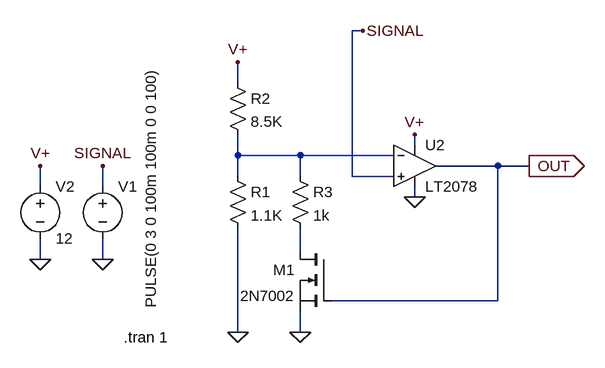
[diagram p0: schematic hysteresis_nfet.asc]
hysteresis_nfet.asc, the LTspice schematic file:
Version 4
SHEET 1 880 680
WIRE 64 -16 48 -16
WIRE -128 64 -128 32
WIRE 144 160 144 144
WIRE -128 176 -128 144
WIRE -32 176 -128 176
WIRE 112 176 -32 176
WIRE 272 192 176 192
WIRE 320 192 272 192
WIRE -128 208 -128 176
WIRE -32 208 -32 176
WIRE 48 208 48 -16
WIRE 112 208 48 208
WIRE -432 224 -432 192
WIRE -336 224 -336 192
WIRE 144 240 144 224
WIRE -32 320 -32 288
WIRE -432 336 -432 304
WIRE -336 336 -336 304
WIRE 272 400 272 192
WIRE 272 400 16 400
WIRE -128 448 -128 288
WIRE -32 448 -32 416
FLAG -128 448 0
FLAG -432 336 0
FLAG -432 192 V+
FLAG 144 144 V+
FLAG -128 32 V+
FLAG -336 192 SIGNAL
FLAG 64 -16 SIGNAL
FLAG -336 336 0
FLAG -32 448 0
FLAG 320 192 OUT
IOPIN 320 192 Out
FLAG 144 240 0
SYMBOL res -144 192 R0
SYMATTR InstName R1
SYMATTR Value 1.1K
SYMBOL res -144 48 R0
SYMATTR InstName R2
SYMATTR Value 8.5K
SYMBOL voltage -336 208 R0
WINDOW 123 0 0 Left 2
WINDOW 39 0 0 Left 2
WINDOW 3 74 -168 VRight 2
SYMATTR Value PULSE(0 3 0 100m 100m 0 0 100)
SYMATTR InstName V1
SYMBOL voltage -432 208 R0
WINDOW 123 0 0 Left 2
WINDOW 39 0 0 Left 2
SYMATTR InstName V2
SYMATTR Value 12
SYMBOL nmos 16 320 M0
SYMATTR InstName M1
SYMATTR Value 2N7002
SYMBOL res -48 192 R0
SYMATTR InstName R3
SYMATTR Value 1k
SYMBOL Opamps\\LT2078 144 128 R0
SYMATTR InstName U2
TEXT -304 456 Left 2 !.tran 1

The netlist it stands for:
* hysteresis_nfet.asc
R1 N001 0 1.1K
R2 V+ N001 8.5K
V1 SIGNAL 0 PULSE(0 3 0 100m 100m 0 0 100)
V2 V+ 0 12
M1 N002 OUT 0 0 2N7002
R3 N001 N002 1k
XU2 SIGNAL N001 V+ 0 OUT LT2078  ; pins In+ In- V+ V- OUT
.model NMOS NMOS
.model PMOS PMOS
.lib standard.mos
.tran 1
.backanno
.end